# EAGLE design W-BT (EAGLE 9.4.0)
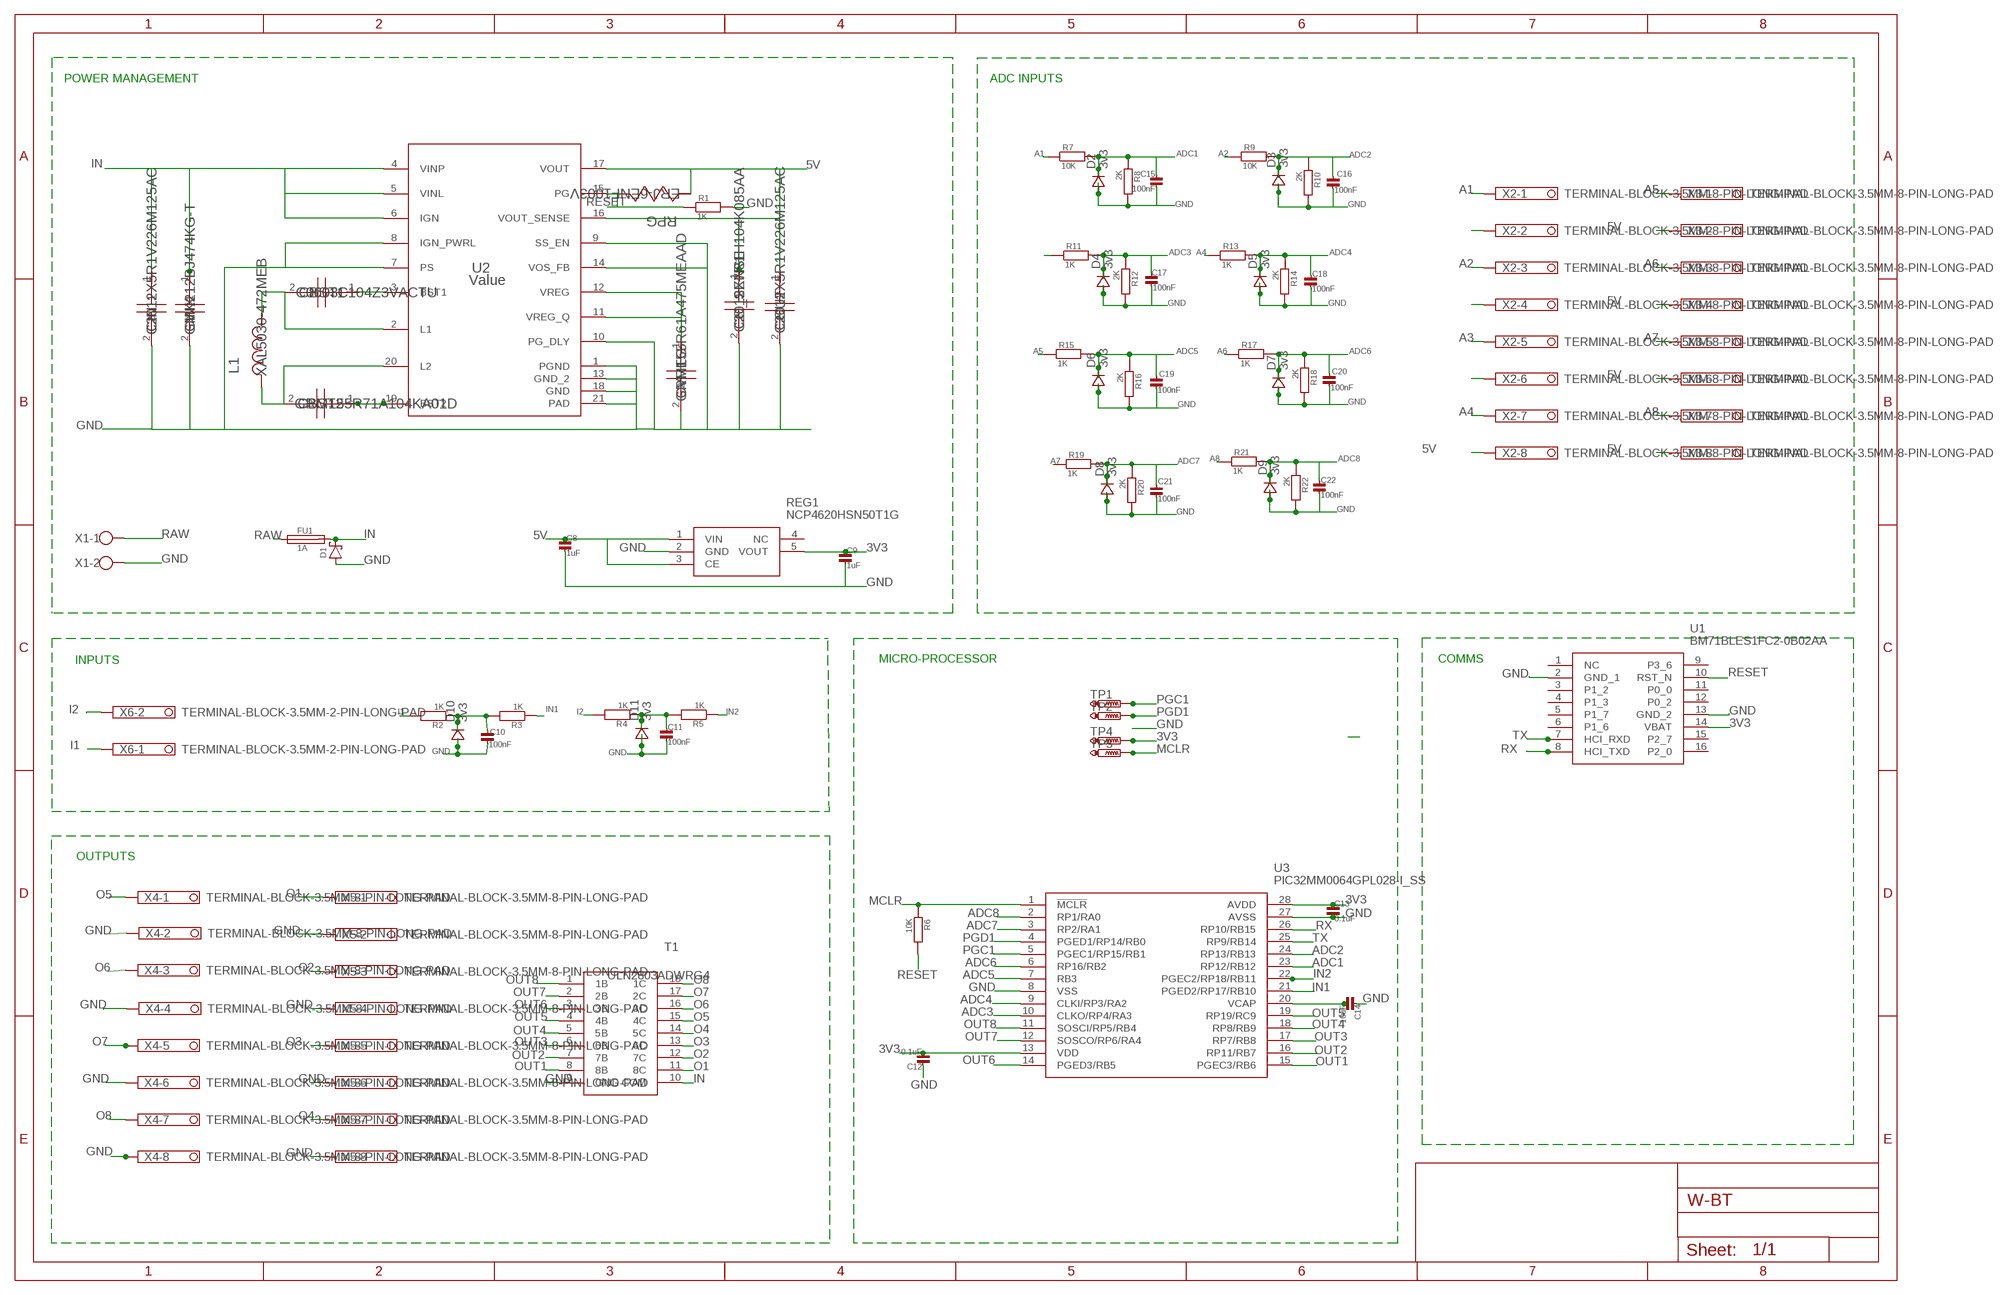
[diagram p0: schematic, sheet 1]

## Parts
C8  1uF  CC0402  [C0402]
C9  1uF  CC0402  [C0402]
C10  100nF  CC0402  [C0402]
C11  100nF  CC0402  [C0402]
C12  0.1uF  CC0402  [C0402]
C13  0.1uF  CC0402  [C0402]
C14  10uF  CC0402  [C0402]
C15  100nF  CC0402  [C0402]
C16  100nF  CC0402  [C0402]
C17  100nF  CC0402  [C0402]
C18  100nF  CC0402  [C0402]
C19  100nF  CC0402  [C0402]
C20  100nF  CC0402  [C0402]
C21  100nF  CC0402  [C0402]
C22  100nF  CC0402  [C0402]
CBST1  C0603C104Z3VACTU  [0603]
CBST2  GRM155R71A104KA01D  [0402]
CIN  C2012X5R1V226M125AC  [0805]
CINX  GMK212BJ474KG-T  [0805]
CO_SENSE  C2012X7R1H104K085AA  [0805]
COUT  C2012X5R1V226M125AC  [0805]
CVREG  GRM155R61A475MEAAD  [0402]
D1  SCHOTTKY-DIODESMD  [SMB]
D2  3v3  DSOD323  [SOD323]
D3  3v3  DSOD323  [SOD323]
D4  3v3  DSOD323  [SOD323]
D5  3v3  DSOD323  [SOD323]
D6  3v3  DSOD323  [SOD323]
D7  3v3  DSOD323  [SOD323]
D8  3v3  DSOD323  [SOD323]
D9  3v3  DSOD323  [SOD323]
D10  3v3  DSOD323  [SOD323]
D11  3v3  DSOD323  [SOD323]
FU1  1A  MF-SMDF050  [MF-SMDF050]
L1  XAL5030-472MEB  [XAL5030]
R1  1K  RR0402  [R0402]
R2  1K  RR0402  [R0402]
R3  1K  RR0402  [R0402]
R4  1K  RR0402  [R0402]
R5  1K  RR0402  [R0402]
R6  10K  RR0402  [R0402]
R7  10K  RR0402  [R0402]
R8  2K  RR0402  [R0402]
R9  10K  RR0402  [R0402]
R10  2K  RR0402  [R0402]
R11  1K  RR0402  [R0402]
R12  2K  RR0402  [R0402]
R13  1K  RR0402  [R0402]
R14  2K  RR0402  [R0402]
R15  1K  RR0402  [R0402]
R16  2K  RR0402  [R0402]
R17  1K  RR0402  [R0402]
R18  2K  RR0402  [R0402]
R19  1K  RR0402  [R0402]
R20  2K  RR0402  [R0402]
R21  1K  RR0402  [R0402]
R22  2K  RR0402  [R0402]
REG1  NCP4620HSN50T1G  [SOT95P280X145-5N]
RPG  ERJ-6ENF1003V  [0805]
T1  ULN2803ADWRG4  [SOIC127P1030X265-18N]
TP1  PTR1TP13R  [TP13R]
TP2  PTR1TP13R  [TP13R]
TP4  PTR1TP13R  [TP13R]
TP5  PTR1TP13SQ  [TP13SQ]
U1  BM71BLES1FC2-0B02AA  [BM71BLES1FC2_1]
U2  Value  TPS55165QPWPRQ1  [PWP0020P_N]
U3  PIC32MM0064GPL028-I_SS  [SOP65P780X200-28N]
X1  W237-102  [W237-102]
X2  TERMINAL-BLOCK-3.5MM-8-PIN-LONG-PAD  [TERMINAL-BLOCK-8-PIN-3.5MM-LONG-PAD]
X3  TERMINAL-BLOCK-3.5MM-8-PIN-LONG-PAD  [TERMINAL-BLOCK-8-PIN-3.5MM-LONG-PAD]
X4  TERMINAL-BLOCK-3.5MM-8-PIN-LONG-PAD  [TERMINAL-BLOCK-8-PIN-3.5MM-LONG-PAD]
X5  TERMINAL-BLOCK-3.5MM-8-PIN-LONG-PAD  [TERMINAL-BLOCK-8-PIN-3.5MM-LONG-PAD]
X6  TERMINAL-BLOCK-3.5MM-2-PIN-LONG-PAD  [TERMINAL-BLOCK-2-PIN-3.5MM-LONG-PAD]

## Nets
3V3: C9.1 C12.2 C13.1 REG1.5(VOUT) TP4.TP U1.14(VBAT) U3.13(VDD) U3.28(AVDD)
5V: C8.1 CO_SENSE.1 COUT.1 REG1.1(VIN) REG1.3(CE) RPG.2 U2.16(VOUT_SENSE) U2.17(VOUT) X2.2 X2.4 X2.6 X2.8 X3.2 X3.4 X3.6 X3.8
A1: R7.1 X2.1
A2: R9.1 X2.3
A3: R11.1 X2.5
A4: R13.1 X2.7
A5: R15.1 X3.1
A6: R17.1 X3.3
A7: R19.1 X3.5
A8: R21.1 X3.7
ADC1: C15.1 D2.1(C) R7.2 R8.1 U3.23(RP12/RB12)
ADC2: C16.1 D3.1(C) R9.2 R10.1 U3.24(RP13/RB13)
ADC3: C17.1 D4.1(C) R11.2 R12.1 U3.10(CLKO/RP4/RA3)
ADC4: C18.1 D5.1(C) R13.2 R14.1 U3.9(CLKI/RP3/RA2)
ADC5: C19.1 D6.1(C) R15.2 R16.1 U3.7(RB3)
ADC6: C20.1 D7.1(C) R17.2 R18.1 U3.6(RP16/RB2)
ADC7: C21.1 D8.1(C) R19.2 R20.1 U3.3(RP2/RA1)
ADC8: C22.1 D9.1(C) R21.2 R22.1 U3.2(RP1/RA0)
GND: C8.2 C9.2 C10.2 C11.2 C12.1 C13.2 C14.1 C15.2 C16.2 C17.2 C18.2 C19.2 C20.2 C21.2 C22.2 CIN.2 CINX.2 CO_SENSE.2 COUT.2 CVREG.2 D1.A D2.2(A) D3.2(A) D4.2(A) D5.2(A) D6.2(A) D7.2(A) D8.2(A) D9.2(A) D10.2(A) D11.2(A) R1.2 R8.2 R10.2 R12.2 R14.2 R16.2 R18.2 R20.2 R22.2 REG1.2(GND) T1.9(GND) U1.2(GND_1) U1.13(GND_2) U2.1(PGND) U2.7(PS) U2.8(IGN_PWRL) U2.9(SS_EN) U2.10(PG_DLY) U2.13(GND_2) U2.14(VOS_FB) U2.18(GND) U2.21(PAD) U3.8(VSS) U3.27(AVSS) X1.2 X4.2 X4.4 X4.6 X4.8 X5.2 X5.4 X5.6 X5.8
I1: R2.2 X6.1
I2: R4.2 X6.2
IN: CIN.1 CINX.1 D1.C FU1.2 T1.10(COM) U2.4(VINP) U2.5(VINL) U2.6(IGN)
IN1: R3.1 U3.21(PGED2/RP17/RB10)
IN2: R5.1 U3.22(PGEC2/RP18/RB11)
MCLR: R6.1 TP5.TP U3.1(!MCLR)
N$2: CBST2.1 U2.19(BST2)
N$3: CBST2.2 L1.1 U2.20(L2)
N$10: CBST1.1 U2.3(BST1)
N$11: CBST1.2 L1.2 U2.2(L1)
N$14: CVREG.1 U2.11(VREG_Q) U2.12(VREG)
N$20: C14.2 U3.20(VCAP)
O1: T1.11(8C) X5.1
O2: T1.12(7C) X5.3
O3: T1.13(6C) X5.5
O4: T1.14(5C) X5.7
O5: T1.15(4C) X4.1
O6: T1.16(3C) X4.3
O7: T1.17(2C) X4.5
O8: T1.18(1C) X4.7
OUT1: T1.8(8B) U3.15(PGEC3/RB6)
OUT2: T1.7(7B) U3.16(RP11/RB7)
OUT3: T1.6(6B) U3.17(RP7/RB8)
OUT4: T1.5(5B) U3.18(RP8/RB9)
OUT5: T1.4(4B) U3.19(RP19/RC9)
OUT6: T1.3(3B) U3.14(PGED3/RB5)
OUT7: T1.2(2B) U3.12(SOSCO/RP6/RA4)
OUT8: T1.1(1B) U3.11(SOSCI/RP5/RB4)
PGC1: TP1.TP U3.5(PGEC1/RP15/RB1)
PGD1: TP2.TP U3.4(PGED1/RP14/RB0)
R18LEG: C10.1 D10.1(C) R2.1 R3.2
R20LEG: C11.1 D11.1(C) R4.1 R5.2
RAW: FU1.1 X1.1
RESET: R1.1 R6.2 RPG.1 U1.10(RST_N) U2.15(PG)
RX: U1.8(HCI_TXD) U3.26(RP10/RB15)
TX: U1.7(HCI_RXD) U3.25(RP9/RB14)
Unconnected: REG1.4(NC) U1.1(NC) U1.3(P1_2) U1.4(P1_3) U1.5(P1_7) U1.6(P1_6) U1.9(P3_6) U1.11(P0_0) U1.12(P0_2) U1.15(P2_7) U1.16(P2_0)

## Notes on the sheet
- POWER MANAGEMENT | ADC INPUTS
- INPUTS | MICRO-PROCESSOR | COMMS
- OUTPUTS

## Library data of the parts
C8-C22 = eagle-ltspice:C: CAPACITOR, European symbol
CBST1 = POWER_CIRCUIT_TPS55165:C0603C104Z3VACTU; CAP: 1.0E7; ESR: 0.0; IRMS: 0.0; MANUFACTURER_NAME: Kemet; MANUFACTURER_PART_NUMBER: C0603C104Z3VACTU; VDC: 25.0; VENDOR: Kemet
CBST2 = POWER_CIRCUIT_TPS55165:GRM155R71A104KA01D; CAP: 1.0E7; ESR: 0.0; IRMS: 0.0; MANUFACTURER_NAME: MuRata; MANUFACTURER_PART_NUMBER: GRM155R71A104KA01D; VDC: 10.0; VENDOR: MuRata
CIN COUT = POWER_CIRCUIT_TPS55165:C2012X5R1V226M125AC; CAP: 2.2E5; DATASHEETURL: httpsproduct.tdk.comensearchcapacitorceramicmlccinfo?part%5Fno%3DC2012X5R1V226M125AC; ESR: 0.00205; IRMS: 4.55587; MANUFACTURER_NAME: TDK; MANUFACTURER_PART_NUMBER: C2012X5R1V226M125AC; VDC: 35.0; VENDOR: TDK
CINX = POWER_CIRCUIT_TPS55165:GMK212BJ474KG-T; CAP: 4.7E7; ESR: 0.0; IRMS: 0.0; MANUFACTURER_NAME: Taiyo Yuden; MANUFACTURER_PART_NUMBER: GMK212BJ474KGT; VDC: 35.0; VENDOR: Taiyo Yuden
CO_SENSE = POWER_CIRCUIT_TPS55165:C2012X7R1H104K085AA; CAP: 1.0E7; DATASHEETURL: httpsproduct.tdk.comensearchcapacitorceramicmlccinfo?part%5Fno%3DC2012X7R1H104K085AA; ESR: 0.02619; IRMS: 1.29514; MANUFACTURER_NAME: TDK; MANUFACTURER_PART_NUMBER: C2012X7R1H104K085AA; VDC: 50.0; VENDOR: TDK
CVREG = POWER_CIRCUIT_TPS55165:GRM155R61A475MEAAD; CAP: 4.7E6; DATASHEETURL: httpsearch.murata.co.jpCeramyimageimgA01XG101ENGGRM155R61A475MEAA%2D01.pdf; ESR: 0.0; IRMS: 0.0; MANUFACTURER_NAME: MuRata; MANUFACTURER_PART_NUMBER: GRM155R61A475MEAAD; VDC: 10.0; VENDOR: MuRata
D1 = diode:SCHOTTKY-DIODE: Schottky Diode
D2-D11 = zetex:D: DIODE; MPN: CDSOD323-T05C; OC_FARNELL: 1824860; OC_NEWARK: 79R6078
FU1 = fuse:MF-SMDF: MF-SMDF Series - PRC Resettable Fuses Source: http://www.farnell.com/datasheets/716597.pdf
L1 = POWER_CIRCUIT_TPS55165:XAL5030-472MEB; DCR: 0.04; IDC: 5.9; L: 4.7E6; MANUFACTURER_NAME: Coilcraft; MANUFACTURER_PART_NUMBER: XAL5030472MEB; VENDOR: Coilcraft
R1-R22 = eagle-ltspice:R: RESISTOR, European symbol
REG1 = SamacSys_Parts:NCP4620HSN50T1G: Source: Datasheet <http://www.onsemi.com/pub/Collateral/NCP4620-D.PDF>; ALLIED_NUMBER: 70340704; ALLIED_PRICE-STOCK: http://www.alliedelec.com/on-semiconductor-ncp4620hsn50t1g/70340704/; HEIGHT: 1.45mm; MANUFACTURER_NAME: ON Semiconductor; MANUFACTURER_PART_NUMBER: NCP4620HSN50T1G; MOUSER_PART_NUMBER: 863-NCP4620HSN50T1G; MOUSER_PRICE-STOCK: https://www.mouser.com/Search/Refine.aspx?Keyword=863-NCP4620HSN50T1G; RS_PART_NUMBER: 7484802; RS_PRICE-STOCK: https://uk.rs-online.com/web/p/products/7484802
RPG = POWER_CIRCUIT_TPS55165:ERJ-6ENF1003V; MANUFACTURER_NAME: Panasonic; MANUFACTURER_PART_NUMBER: ERJ6ENF1003V; POWER: 0.125; RESISTANCE: 100000.0; TOLERANCE: 1.0; VENDOR: Panasonic
T1 = SamacSys_Parts:ULN2803ADWRG4: Darlington Transistors TRANSISTOR ARRAYS Source: Datasheet <http://www.ti.com/lit/ds/symlink/uln2803a.pdf>; DESCRIPTION: Darlington Transistors TRANSISTOR ARRAYS; HEIGHT: 2.65mm; MANUFACTURER_NAME: Texas Instruments; MANUFACTURER_PART_NUMBER: ULN2803ADWRG4; MOUSER_PART_NUMBER: 595-ULN2803ADWRG4; MOUSER_PRICE-STOCK: https://www.mouser.com/Search/Refine.aspx?Keyword=595-ULN2803ADWRG4
TP1 TP2 TP4 TP5 = testpad:PTR1: TEST PIN
U1 = SamacSys_Parts:BM71BLES1FC2-0B02AA: Bluetooth / 802.15.1 Modules Source: Datasheet <http://www.microchip.com/mymicrochip/filehandler.aspx?ddocname=en578477>; DESCRIPTION: Bluetooth / 802.15.1 Modules; HEIGHT: mm; MANUFACTURER_NAME: Microchip; MANUFACTURER_PART_NUMBER: BM71BLES1FC2-0B02AA; MOUSER_PART_NUMBER: 579-71BLES1FC20B02AA; MOUSER_PRICE-STOCK: https://www.mouser.com/Search/Refine.aspx?Keyword=579-71BLES1FC20B02AA; RS_PART_NUMBER: 1717856P; RS_PRICE-STOCK: http://uk.rs-online.com/web/p/products/1717856P
U2 = POWER_CIRCUIT_TPS55165:TPS55165QPWPRQ1; MANUFACTURER: Texas Instruments; MANUFACTURER_NAME: Texas Instruments; MANUFACTURER_PART_NUMBER: TPS55165QPWPRQ1; PARTNUMBER: TPS55165PWPQ1; REFDES: RefDes; TYPE: TYPE
U3 = SamacSys_Parts:PIC32MM0064GPL028-I_SS: MCU,PIC32MM,microAptiv,64KB Flash,SSOP28 Microchip PIC32MM0064GPL028-I/SS, 32bit PIC Microcontroller, 25MHz, 64 kB Flash, 28-Pin SSOP Source: Datasheet <https://componentsearchengine.com/Datasheets/2/PIC32MM0064GPL028-I_SS.pdf>; DESCRIPTION: MCU,PIC32MM,microAptiv,64KB Flash,SSOP28 Microchip PIC32MM0064GPL028-I/SS, 32bit PIC Microcontroller, 25MHz, 64 kB Flash, 28-Pin SSOP; HEIGHT: 2mm; MANUFACTURER_NAME: Microchip; MANUFACTURER_PART_NUMBER: PIC32MM0064GPL028-I/SS; MOUSER_PART_NUMBER: 579-2MM0064GPL028ISS; MOUSER_PRICE-STOCK: https://www.mouser.com/Search/Refine.aspx?Keyword=579-2MM0064GPL028ISS; RS_PART_NUMBER: 1463267; RS_PRICE-STOCK: https://uk.rs-online.com/web/p/products/1463267
X1 = con-wago-500:W237-102: WAGO SCREW CLAMP; MPN: 237-102; OC_FARNELL: unknown; OC_NEWARK: 70K9898
X2-X5 = Rembrandt Electronics - Terminal Block 3-5mm v1-0:TERMINAL-BLOCK-3.5MM-8-PIN: Terminal Block 3.5mm Pitch: 3,5 mm Number of pins: 8 Created by Rembrandt Electronics www.rembrandtelectronics.com
X6 = Rembrandt Electronics - Terminal Block 3-5mm v1-0:TERMINAL-BLOCK-3.5MM-2-PIN: Terminal Block 3.5mm Pitch: 3,5 mm Number of pins: 2 Created by Rembrandt Electronics www.rembrandtelectronics.com

## Board
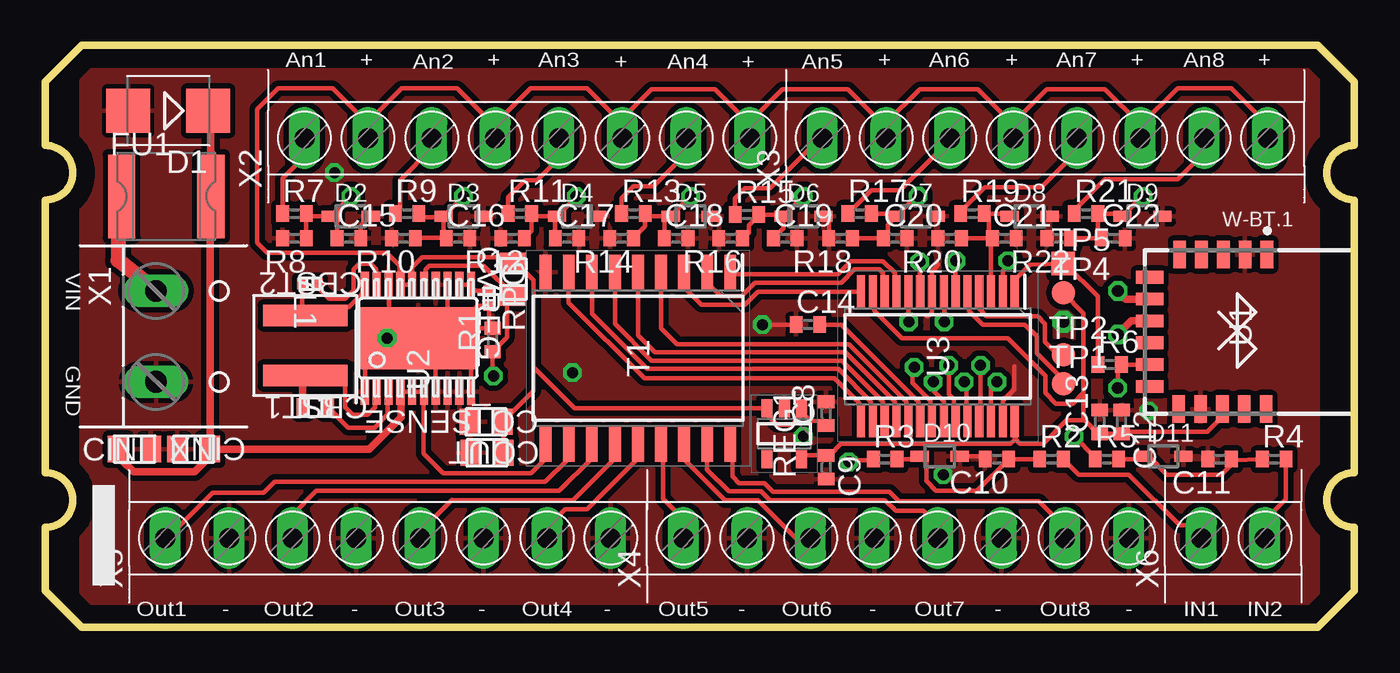
[diagram p1: board, top side]
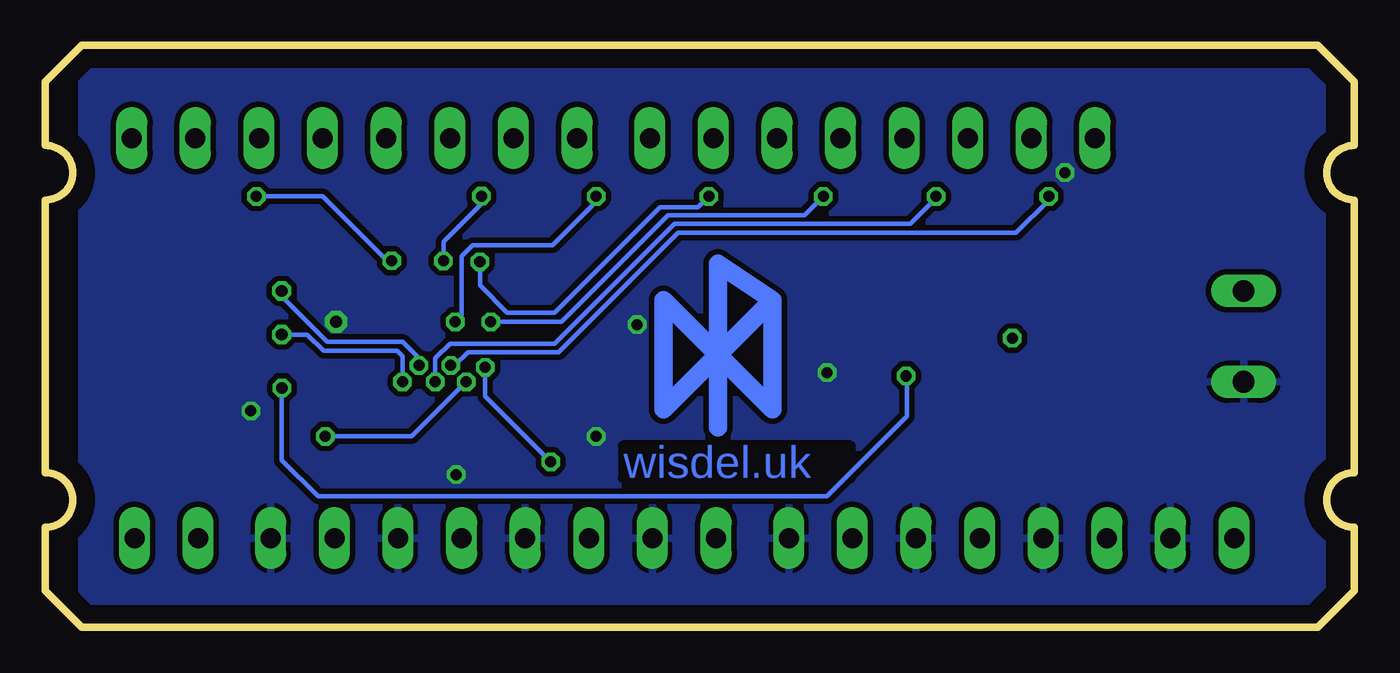
[diagram p2: board, bottom side, seen from below]

Size 72 x 32 mm. Coordinates in mm from the lower left corner, seen from the top.
Outline: 2,0 70,0 72,2 72,5.5 arc-180 72,8.5 72,23.5 arc-180 72,26.5 72,30 70,32 2,32 0,30 0,26.5 arc-180 0,23.5 0,8.5 arc-180 0,5.5 0,2 2,0
Copper layers (1*16): Top 0.035mm / dielectric 1.5mm / Bottom 0.035mm
Design rules "default *": minimum track width 10mil, minimum drill 24mil, track to track 8mil, track to pad 8mil, pad to pad 8mil, via to via 8mil, smd to smd 8mil, copper to edge 40mil, drill to drill 8mil, minimum pad ring 10mil, minimum via ring 8mil, stop-mask expansion 4mil, vias tented up to drill 0mil, thermal gap 10mil

### Footprints (pad centres in the part's own frame; a part is rotated, then mirrored left to right if it is on the bottom)
C0402 = smd 0.7 x 0.9: 1 -0.65,0; 2 0.65,0
0603 = smd 0.66 x 0.965: 1 -0.699,0; 2 0.699,0
0402 = smd 0.559 x 0.61: 1 -0.419,0; 2 0.419,0
0805 = smd 1.118 x 1.448: 1 -0.902,0; 2 0.902,0
SMB = smd 2.4 x 2.4: A 2.2,0; C -2.2,0
SOD323 = smd 1 x 0.6: 1 -1.1,0; 2 1.1,0
MF-SMDF050 = smd 1.5 x 4.6: 1 -2.45,0; 2 2.45,0
XAL5030 = smd 1.168 x 4.648: 1 -1.651,0; 2 1.651,0
R0402 = smd 0.7 x 0.9: 1 -0.65,0; 2 0.65,0
SOT95P280X145-5N = smd 1 x 0.6: 1 -1.4,0.95; 2 -1.4,0; 3 -1.4,-0.95; 4 1.4,-0.95; 5 1.4,0.95
SOIC127P1030X265-18N = smd 1.95 x 0.65: 1 -4.725,5.08; 2 -4.725,3.81; 3 -4.725,2.54; 4 -4.725,1.27; 5 -4.725,0; 6 -4.725,-1.27; 7 -4.725,-2.54; 8 -4.725,-3.81; 9 -4.725,-5.08; 10 4.725,-5.08; 11 4.725,-3.81; 12 4.725,-2.54; 13 4.725,-1.27; 14 4.725,0; 15 4.725,1.27; 16 4.725,2.54; 17 4.725,3.81; 18 4.725,5.08
TP13R = smd 1.3 x 1.3: TP 0,0
TP13SQ = smd 1.3 x 1.3: TP 0,0
BM71BLES1FC2_1 = smd 1.5 x 0.7: 1 -8.75,6.7; 2 -8.75,5.5; 3 -8.75,4.3; 4 -8.75,3.1; 5 -8.75,1.9; 12 -0.25,1.85; 13 -0.25,3.05; 14 -0.25,4.25; 15 -0.25,5.45; 16 -0.25,6.65 | smd 0.7 x 1.5: 6 -7.5,0.25; 7 -6.3,0.25; 8 -5.1,0.25; 9 -3.9,0.25; 10 -2.7,0.25; 11 -1.5,0.25
PWP0020P_N = smd 1.4 x 0.45: 1 -2.95,2.925; 2 -2.95,2.275; 3 -2.95,1.625; 4 -2.95,0.975; 5 -2.95,0.325; 6 -2.95,-0.325; 7 -2.95,-0.975; 8 -2.95,-1.625; 9 -2.95,-2.275; 10 -2.95,-2.925; 11 2.95,-2.925; 12 2.95,-2.275; 13 2.95,-1.625; 14 2.95,-0.975; 15 2.95,-0.325; 16 2.95,0.325; 17 2.95,0.975; 18 2.95,1.625; 19 2.95,2.275; 20 2.95,2.925 | smd 3.4 x 6.5: 21 0,0
SOP65P780X200-28N = smd 1.8 x 0.45: 1 -3.55,4.225; 2 -3.55,3.575; 3 -3.55,2.925; 4 -3.55,2.275; 5 -3.55,1.625; 6 -3.55,0.975; 7 -3.55,0.325; 8 -3.55,-0.325; 9 -3.55,-0.975; 10 -3.55,-1.625; 11 -3.55,-2.275; 12 -3.55,-2.925; 13 -3.55,-3.575; 14 -3.55,-4.225; 15 3.55,-4.225; 16 3.55,-3.575; 17 3.55,-2.925; 18 3.55,-2.275; 19 3.55,-1.625; 20 3.55,-0.975; 21 3.55,-0.325; 22 3.55,0.325; 23 3.55,0.975; 24 3.55,1.625; 25 3.55,2.275; 26 3.55,2.925; 27 3.55,3.575; 28 3.55,4.225
W237-102 = drill 1.194 long: 1 -2.5,-1.27; 2 2.5,-1.27
TERMINAL-BLOCK-8-PIN-3.5MM-LONG-PAD = drill 1.1 pad 1.7 long: 1 -12.25,-0.1; 2 -8.75,-0.1; 3 -5.25,-0.1; 4 -1.75,-0.1; 5 1.75,-0.1; 6 5.25,-0.1; 7 8.75,-0.1; 8 12.25,-0.1
TERMINAL-BLOCK-2-PIN-3.5MM-LONG-PAD = drill 1.1 pad 1.7 long: 1 -1.75,-0.1; 2 1.75,-0.1

### Placement (x,y rotation side)
C8  42.95,11.75 90 top
C9  42.95,8.8 270 top
C10  52.35,9.25 180 top
C11  64.6,9.25 180 top
C12  59.2,11.3 270 top
C13  58,11.3 90 top
C14  41.95,16.65 0 top
C15  16.7,21.4 0 top
C16  22.7,21.4 0 top
C17  28.7,21.4 0 top
C18  34.7,21.4 0 top
C19  40.7,21.4 0 top
C20  46.75,21.4 0 top
C21  52.75,21.4 0 top
C22  58.75,21.4 0 top
CBST1  14.85,12.1 180 top
CBST2  14.55,18.9 180 top
CIN  4.9,9.8 0 top
CINX  8.15,9.8 180 top
CO_SENSE  24.25,11.3 180 top
COUT  24.3,9.6 180 top
CVREG  24.4,18.1 270 top
D1  6.75,28.41 180 top
D2  16.8,22.6 0 top
D3  23,22.6 0 top
D4  29.25,22.6 0 top
D5  35.5,22.6 0 top
D6  41.7,22.6 0 top
D7  47.9,22.6 0 top
D8  54.15,22.6 0 top
D9  60.35,22.6 0 top
D10  49.2,9.4 0 top
D11  61.5,9.4 0 top
FU1  6.65,23.7 0 top
L1  14.3,15.5 270 top
R1  24.6,15.8 90 top
R2  55.35,9.25 0 top
R3  46.2,9.25 0 top
R4  67.6,9.25 0 top
R5  58.4,9.25 0 top
R6  58.55,14.45 0 top
R7  13.7,22.75 0 top
R8  13.7,21.4 180 top
R9  19.9,22.75 0 top
R10  19.7,21.4 180 top
R11  26.1,22.75 0 top
R12  25.7,21.4 180 top
R13  32.35,22.75 0 top
R14  31.7,21.4 180 top
R15  38.6,22.7 0 top
R16  37.7,21.4 180 top
R17  44.8,22.75 0 top
R18  43.75,21.4 180 top
R19  51,22.75 0 top
R20  49.75,21.4 180 top
R21  57.25,22.75 0 top
R22  55.75,21.4 180 top
REG1  40.65,10.65 270 top
RPG  25.75,19.15 90 top
T1  32.6,14.8 270 top
TP1  56,13.4 0 top
TP2  56,15 0 top
TP4  56,18.4 0 top
TP5  56,20 0 top
U1  60.5,11.75 270 top
U2  20.5,15.9 90 top
U3  49.1,14.9 270 top
X1  7.35,16 270 top
X2  26.5,27 0 top
X3  55,27 0 top
X4  47.35,5 0 top
X5  18.85,5 0 top
X6  65.35,5 0 top

### Tracks (layer width: path | path; a pad name or v marks a point on that pad's centre or on a via)
3V3
  Top 0.254: U3.28 53.38,11.4 | U1.14 64.75,11.58 63.92,10.75 59.3,10.75 C12.2 C13.1 | REG1.5 41.8,9.45 C9.1 43.17,9.45 43.77,10.1 53.08,10.1 53.33,10.32 53.33,10.4 | TP4.TP 57.12,17.28 57.12,12.91 | 53.3,11.8 53.3,11.38 U3.28 | 58,10.68 C13.1 | 57.12,12.91 56.52,12.31 55.61,12.31 55.02,12.89 55.02,13.85 52.97,15.9 47.13,15.9 45.62,17.41 45.62,18.36 U3.13 | C13.1 57.9,10.65 57.17,11.38 | 57.17,11.38 57.12,11.43 57.12,12.91 | U3.28 53.33,10.4 | 57.17,11.38 56.17,11.38 54.9,10.1 53.62,10.1 53.33,10.4
5V
  Top 0.254: X3.8 67.25,27.65 65.25,29.65 62.3,29.65 60.25,27.6 X3.6 60.2,26.95 60.2,27.7 58.3,29.6 55.1,29.6 53.25,27.75 X3.4 53.25,27.65 51.3,29.6 48.1,29.6 46.25,27.75 X3.2 46.25,27.5 44.15,29.6 40.55,29.6 38.75,27.8 X2.8 38.8,26.95 38.8,27.65 36.85,29.6 33.35,29.6 31.75,28 X2.6 31.75,27.7 29.8,29.65 26.7,29.65 24.75,27.7 X2.4 24.75,27.55 22.65,29.65 19.6,29.65 17.75,27.8 X2.2 17.75,27.7 15.8,29.65 12.8,29.65 11.65,28.5 11.65,21.15 12.2,20.6 18.77,20.6 19.48,19.89 19.48,18.95 19.52,18.9 U2.17 U2.16 20.18,19.8 20.73,20.35 25.45,20.35 RPG.2 25.9,20.05 26.85,19.1 26.85,14.3 | 26.85,14.3 29.1,12.05 REG1.3 39.7,11.7 40.25,11.15 41.07,11.15 41.58,11.67 41.6,11.65 REG1.1 | REG1.1 41.55,12.1 | REG1.1 41.6,11.85 42.1,11.35 42.66,11.33 42.68,11.1 C8.1 | COUT.1 25.2,11.25 CO_SENSE.1 26.85,13 26.85,14.3
A1
  Top 0.254: R7.1 13.05,24.7 14.25,25.9 X2.1
A2
  Top 0.254: X2.3 21.25,26.35 19.5,24.6 19.5,23 R9.1
A3
  Top 0.254: X2.5 28.25,25.8 27.05,24.6 26.4,24.6 25.45,23.65 R11.1
A4
  Top 0.254: X2.7 35.25,26.05 33.45,24.25 32.35,24.25 31.7,23.6 R13.1
A5
  Top 0.254: X3.1 42.6,26.9 39.85,24.15 38.5,24.15 37.95,23.6 R15.1
A6
  Top 0.254: X3.3 49.75,26.8 47,24.05 45.45,24.05 R17.1
A7
  Top 0.254: X3.5 56.75,26.15 54.8,24.2 51.7,24.2 50.35,22.85 R19.1
A8
  Top 0.254: X3.7 63.75,26.1 62.3,24.65 58.3,24.65 56.6,22.95 R21.1
ADC1  (via drill 0.61)
  Top 0.254: D2.1 14.5,22.6 R7.2 R8.1 | D2.1 v16.8,23.7 | U3.23 49.98,11.45 49.98,12.55 49.7,12.82 v49.7,14.4 | D2.1 16.05,22.25 C15.1
  Bottom 0.254: 16.8,23.5 16.8,23.4 | v49.7,14.4 49.48,14.4 48.75,15.14 43.76,15.14 37.2,21.7 18.6,21.7 16.8,23.5 | 16.8,23.5 v16.8,23.7
ADC2  (via drill 0.61)
  Top 0.254: R9.2 20.55,22.55 21.85,22.55 D3.1 | D3.1 21.9,21.55 22.02,21.43 | 22.02,21.43 20.38,21.43 R10.1 | D3.1 v23,23.7 | U3.24 50.67,11.4 50.67,13.5 v50.55,13.5 | C16.1 22.02,21.43
  Bottom 0.254: v50.55,13.5 50.55,14.8 49.75,15.6 44,15.6 37.4,22.2 24.4,22.2 23,23.6 v23,23.7
ADC3  (via drill 0.61)
  Top 0.254: D4.1 26.9,22.6 R11.2 26.75,21.8 R12.1 | v47.5,16.8 47.48,16.82 U3.10 | D4.1 29.2,23.65 v29.2,23.7 | C17.1 28.05,22.5 D4.1
  Bottom 0.254: v29.2,23.7 30.24,22.66 37.74,22.66 43.6,16.8 v47.5,16.8
ADC4  (via drill 0.61)
  Top 0.254: 34.15,22.6 D5.1 v35.5,23.7 | 34.15,22.6 33.15,22.6 R13.2 33,22.05 R14.1 | U3.9 48.12,20.07 v48.1,20.1 | C18.1 34.05,22.5 34.15,22.6
  Bottom 0.254: v35.5,23.7 36.09,23.11 38.19,23.11 44,17.3 46.6,17.3 48.1,18.8 v48.1,20.1
ADC5  (via drill 0.61)
  Top 0.254: R15.2 39.3,22.7 | 39.3,22.7 40.5,22.7 D6.1 | U3.7 49.45,18.43 v49.45,16.8 | D6.1 v41.7,23.7 | D6.1 40.6,21.95 C19.1 | R16.1 38.65,21.7 38.7,21.7 38.7,22.1 39.3,22.7
  Bottom 0.254: v49.45,16.8 49.1,17.15 49.1,20.4 48.5,21 44.1,21 41.7,23.4 v41.7,23.7
ADC6  (via drill 0.61)
  Top 0.254: R17.2 46.65,22.75 D7.1 | D7.1 46.35,22.15 46.35,21.65 C20.1 R18.1 | D7.1 47.91,23.71 v48.01,23.71 | U3.6 50.08,20.12 v50.1,20.15
  Bottom 0.254: v50.1,20.15 50.1,21.2 48.01,23.29 v48.01,23.71
ADC7
  Top 0.254: R19.2 51.9,22.75 | 51.9,22.75 52.9,22.75 D8.1 | U3.3 51.98,18.5 | 51.9,22.75 51.9,21.6 C21.1 52,21.4 | 52.1,18.52 U3.3 | 52,21.4 R20.1 | U3.3 52.02,21.38 52,21.4
ADC8  (via drill 0.61)
  Top 0.254: v52.95,20.16 52.95,19.88 52.67,19.6 U3.2 | v60.4,23.7 60.35,23.7 D9.1 59.1,22.75 R21.2 57.9,21.6 C22.1 R22.1
  Bottom 0.254: v52.95,20.16 53.2,20.16 56.74,23.7 v60.4,23.7
GND  (via drill 0.61, 0.65 pad 1.2)
  Top 0.254: 21.75,16.7 22.18,17.12 22.12,17.18 U2.13 | 21.75,16.7 21.5,16.45 | 23.4,16.45 R1.2 24.4,16.65 CVREG.2 23.78,17.68 22.74,16.64 22.7,16.64 | 23.4,16.45 21.8,16.45 | 21.8,16.45 21.5,16.45 | 21.75,16.7 21.35,16.7 | C14.1 v39.45,16.65 | U3.27 52.67,12.47 53.3,13.09 53.3,14.35 | 49.1,20 49.1,19.91 48.77,19.59 U3.8 48.77,17.31 48.56,17.1 48.5,17.1 | D6.2 43.1,22.3 R18.2 | D10.2 51.55,9.4 C10.2 | 21.5,16.45 20.95,15.9 18.9,15.9 | U2.18 18.9,18.82 18.9,15.9 | U2.1 17.57,15.2 18.27,15.9 18.9,15.9 | U2.7 21.48,16.12 21.8,16.45 | U2.10 23.43,15.34 23.54,15.45 23.54,16.31 23.4,16.45 | D2.2 17.35,22.05 C15.2
  other vias: 56,16.8 29,14 49.4,8.4 60.7,11.9 41.7,10.5 15.9,25
  pour Top (isolate 0.305): 2,31 70,31 70,1 2,1
  pour Bottom (isolate 0.305): 1.75,1 70,1 70,31 1.75,31
I1
  Top 0.254: R2.2 56.85,8.4 59.6,8.4 62.4,5.6 62.9,5.6 X6.1
I2
  Top 0.254: R4.2 68.25,7.05 67,5.8 67,5 X6.2
IN
  Top 0.254: T1.10 27.52,9.28 26.72,8.47 21.88,8.47 20.8,9.55 20.8,12.95 | 20.8,12.95 U2.5 U2.4 19.54,12.95 19.56,12.93 | 20.8,12.95 U2.6 | CIN.1 4.2,9.6 4.2,9.2
  Top 0.406: 8.95,27.66 D1.C 9.1,28.26 FU1.2 9.05,23.65 CINX.1 | 19.56,12.93 19.56,11.56 17.8,9.8 CINX.1 | 4.05,9.35 4.2,9.2 4.85,8.55 8.2,8.55 9.05,9.4 CINX.1
IN1  (via drill 0.61)
  Top 0.254: v47.8,14.3 47.7,14.2 47.7,13.45 48.68,12.47 48.68,11.45 U3.21 | R3.1 45.5,9.2 44.3,9.2 v44.2,9.1
  Bottom 0.254: v44.2,9.1 47.8,12.7 v47.8,14.3
IN2  (via drill 0.61)
  Top 0.254: v48.85,13.5 48.85,13.4 48.65,13.2 49.42,12.43 U3.22 | v56.6,10.5 57.75,9.35 R5.1
  Bottom 0.254: v56.6,10.5 51.85,10.5 v48.85,13.5
MCLR
  Top 0.254: U3.1 53.33,19.12 54.15,19.95 TP5.TP 56.15,19.95 57.9,18.2 R6.1
N$2
  Top 0.254: CBST2.1 14.97,18.7 15.6,18.07 16.48,18.07 16.97,18.55 16.97,19.69 17.26,19.98 17.89,19.98 18.18,19.69 18.18,18.89 U2.19
N$3
  Top 0.254: CBST2.2 14.13,17.32 L1.1 14.76,17.61 16.68,17.61 17.47,18.4 17.67,18.4 17.67,18.75 U2.20
  Top 0.406: 14.1,18.87 CBST2.2
N$5
  Bottom 1.016: 32,18 32,12 35,15 | 32,18 35,15 | 35,15 38,12 38,18 35,15 | 35,15 35,20 32,18 | 35,15 35,11
N$10
  Top 0.254: CBST1.1 16.66,10.98 18.1,10.98 18.83,11.71 18.83,12.86 18.88,12.9 U2.3
N$11
  Top 0.254: U2.2 18.13,12.86 18.13,12.11 17.72,11.7 16.9,11.7 16.5,12.1 16.5,13.5 16.15,13.85 L1.2 14.25,13.8 14.15,13.8
  Top 0.406: 14.15,13.8 CBST1.2
N$13  (via drill 0.61)
  other vias: 18.8,15.9
N$14
  Top 0.254: U2.12 23.3,18.85 | 23.3,18.85 U2.11 | CVREG.1 23.63,18.52 23.3,18.85
N$20
  Top 0.254: U3.20 48.03,11.45 48.03,12.4 43.78,16.65 C14.2
O1
  Top 0.254: X5.1 6.7,4.9 9.2,7.4 12,7.4 12.6,8 27.5,8 28.75,9.25 28.79,9.29 T1.11
O2
  Top 0.254: X5.3 13.6,6.2 14.9,7.5 28.26,7.5 30.06,9.3 T1.12
O3
  Top 0.254: X5.5 20.6,5.25 22.38,7.03 22.4,7 29.03,7 31.33,9.3 T1.13
O4
  Top 0.254: X5.7 27.6,5.5 28.6,6.5 29.8,6.5 32.6,9.3 T1.14
O5
  Top 0.254: X4.1 35.1,5.95 33.97,7.08 33.97,9.3 33.97,9.97 T1.15
O6
  Top 0.254: X4.3 41.3,4.9 39.2,7 37.39,7 35.14,9.25 T1.16
O7
  Top 0.254: X4.5 49.1,5.6 48.3,6.4 46.8,6.4 46.2,7 39.85,7 39.38,7.47 37.61,7.47 36.41,8.68 T1.17
O8
  Top 0.254: 37.68,9.82 T1.18 37.8,9.96 37.8,8.3 38.17,7.93 39.56,7.93 40.04,7.46 46.44,7.46 46.97,6.93 54.67,6.93 56.1,5.5 X4.7
OUT1
  Top 0.254: U3.15 44.77,11.45 44.77,12.32 43.4,13.7 32.95,13.7 28.79,17.86 T1.8
OUT2
  Top 0.254: U3.16 45.43,11.45 45.43,12.42 43.64,14.21 33.09,14.21 30.06,17.24 T1.7
OUT3
  Top 0.254: U3.17 46.08,11.45 46.08,12.41 43.83,14.66 33.35,14.66 31.33,16.68 T1.6
OUT4
  Top 0.254: U3.18 46.73,11.45 46.73,12.41 44.02,15.12 33.55,15.12 32.6,16.07 T1.5
OUT5
  Top 0.254: U3.19 47.38,11.45 47.38,12.41 44.21,15.58 34.75,15.58 33.87,16.46 T1.4
OUT6
  Top 0.254: T1.3 35.14,18.7 36.1,17.74 38.48,17.74 39.2,18.45 U3.14
OUT7
  Top 0.254: U3.12 46.2,18.48 46.2,19.1 46.08,19.22 46.08,19.49 45.89,19.68 44.51,19.68 43.78,18.95 39.05,18.95 38.29,18.19 37.16,18.19 36.41,18.94 T1.2
OUT8
  Top 0.254: U3.11 46.73,18.55 46.73,19.49 46.08,20.14 44.32,20.14 43.59,19.41 37.8,19.41 T1.1 37.68,18.67 37.7,18.65
PGC1
  Top 0.254: 50.82,18.55 U3.5 50.82,18.36 50.82,17.41 51.59,16.64 53.9,16.64 54.54,16 54.54,15.07 56,13.61 TP1.TP
PGD1
  Top 0.254: U3.4 51.47,18.55 | U3.4 51.47,18.36 | TP2.TP 55.7,15 55,15.7 55,16.7 54.6,17.1 51.78,17.1 51.38,17.51 U3.4
R18LEG
  Top 0.254: 52.97,9.25 C10.1 | D10.1 48.05,9.35 | C10.1 R2.1 | D10.1 47.9,9.4 47.75,9.25 R3.2 | D10.1 48.46,9.04 48.46,8.05 49,7.51 49,7.5 51.25,7.5 C10.1
R20LEG
  Top 0.254: R4.1 65.3,9.2 C11.1 65.25,8.95 64.7,8.4 61.7,8.4 60.7,9.4 D11.1 60.25,9.25 R5.2
RAW
  Top 0.254: FU1.1 4.1,23.7 4,23.8
  Top 0.813: X1.1 4,20.18 4,23.8
RESET  (via drill 0.61)
  Top 0.254: RPG.1 24.12,19.88 21.7,19.88 21.56,19.88 21.11,19.88 20.92,19.69 20.92,19.2 20.82,19.11 U2.15 | v24.65,13.82 24.6,14 R1.1 25.4,15.95 25.4,17.9 RPG.1 | U1.10 R6.2 59,14.25 59,13.17 v58.99,13.16 | RPG.1 25.72,18.22 25.72,18.18 25.75,18.21 RPG.1
  Bottom 0.254: 24.75,13.82 v24.65,13.82 24.6,13.77 24.6,11.6 29,7.2 57,7.2 59,9.2 v59,13.15 v58.99,13.16
RX  (via drill 0.61, 0.65)
  Top 0.254: U3.26 52.02,13.29 52.23,13.5 v52.35,13.5
  Top 0.406: v59,16.1 59.75,16.85 U1.8
  Bottom 0.254: v52.35,13.5 52.35,14.9 52.65,15.2 56.7,15.2 57.6,16.1 v59,16.1
TX  (via drill 0.61, 0.65)
  Top 0.254: v51.45,14.4 51.45,12.07 51.38,12 U3.25
  Top 0.406: U1.7 59.45,18.05 v59,18.5
  Bottom 0.254: v51.45,14.4 51.45,14.8 52.35,15.7 56.5,15.7 59,18.2 v59,18.5

### Text on the board
Bottom: wisdel.uk
tPlace: An1 | + | An2 | + | An3 | + | An4 | + | An5 | + | An6 | + | An7 | + | An8 | + | W-BT.1 | VIN | GND | Out1 | - | Out2 | - | Out3 | - | Out4 | - | Out5 | - | Out6 | - | Out7 | - | Out8 | - | IN1 | IN2